# Altium schematic sheet SHT30-DIS-B10KS1_SHT30-DIS-B10KS.schdoc
size 124 x 101 mm
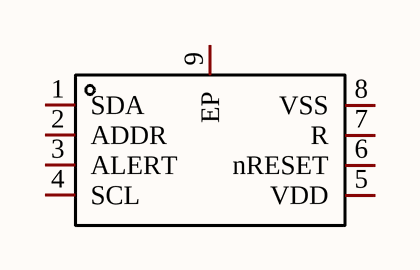
[diagram p0: SHT30-DIS-B10KS1_SHT30-DIS-B10KS.schdoc]

## Parts
U?  SHT30-DIS-B10KS  [DFN-8_L2.5-W2.5-P0.50-BL-EP]  (value not drawn)

## Nets

Not connected (* = marked no-connect by the designer): U? 1(SDA) 2(ADDR) 3(ALERT) 4(SCL) 5(VDD) 6(nRESET) 7(R) 8(VSS) 9(EP)

## Library data of the parts
U? = SHT30-DIS-B10KS: Manufacturer: Sensirion(瑞士盛思锐); Add into BOM: yes; Supply Voltage: 2.4V~5.5V; Name: SHT30-DIS-B10KS; Symbol: SHT30-DIS-B10KS; Device: SHT30-DIS-B10KS; LCSC Part Name: 1-101173-01; Supplier Part: C2687423; Manufacturer Part: SHT30-DIS-B10KS; Supplier Footprint: DFN-8-EP(2.5x2.5); JLCPCB Part Class: Extended Part; Datasheet: https://atta.szlcsc.com/upload/public/pdf/source/20210120/C2687423_31DB3FACC3E95675626B9DEF500B4777.pdf; Supplier: LCSC; Convert to PCB: yes